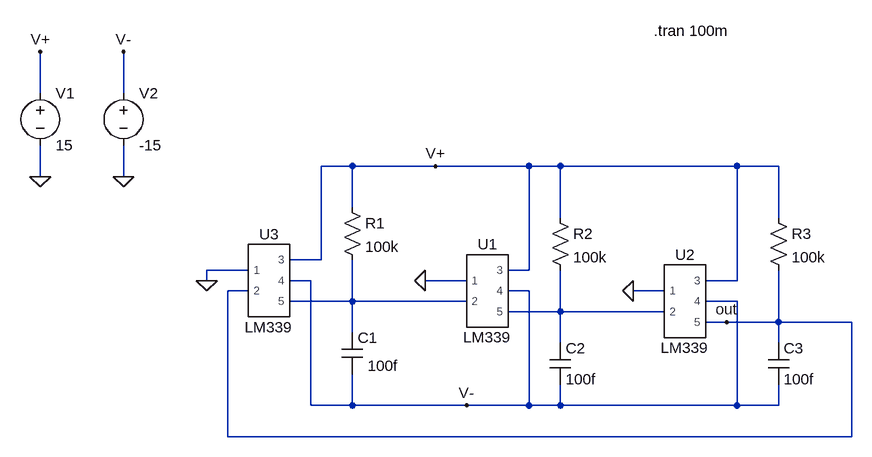
[diagram p0: schematic LM339_schema.asc]
LM339_schema.asc, the LTspice schematic file:
Version 4
SHEET 1 880 680
WIRE -512 -112 -512 -176
WIRE -384 -112 -384 -176
WIRE -32 0 -80 0
WIRE 96 0 -32 0
WIRE 240 0 96 0
WIRE 288 0 240 0
WIRE 560 0 288 0
WIRE 624 0 560 0
WIRE -512 16 -512 -32
WIRE -384 16 -384 -32
WIRE -32 64 -32 0
WIRE 288 80 288 0
WIRE 624 80 624 0
WIRE -80 144 -80 0
WIRE -80 144 -128 144
WIRE -192 160 -256 160
WIRE 240 160 240 0
WIRE 240 160 208 160
WIRE -256 176 -256 160
WIRE -96 176 -128 176
WIRE 144 176 80 176
WIRE 560 176 560 0
WIRE 560 176 512 176
WIRE -192 192 -224 192
WIRE 240 192 208 192
WIRE 448 192 400 192
WIRE -32 208 -32 144
WIRE -32 208 -128 208
WIRE 144 208 -32 208
WIRE 560 208 512 208
WIRE 288 224 288 160
WIRE 288 224 208 224
WIRE 448 224 288 224
WIRE 544 240 512 240
WIRE 624 240 624 160
WIRE 624 240 544 240
WIRE 736 240 624 240
WIRE -32 256 -32 208
WIRE 288 272 288 224
WIRE 624 272 624 240
WIRE -96 368 -96 176
WIRE -32 368 -32 320
WIRE -32 368 -96 368
WIRE 144 368 -32 368
WIRE 240 368 240 192
WIRE 240 368 144 368
WIRE 288 368 288 336
WIRE 288 368 240 368
WIRE 560 368 560 208
WIRE 560 368 288 368
WIRE 624 368 624 336
WIRE 624 368 560 368
WIRE -224 416 -224 192
WIRE 736 416 736 240
WIRE 736 416 -224 416
FLAG -256 176 0
FLAG 96 0 V+
FLAG 144 368 V-
FLAG 80 176 0
FLAG 400 192 0
FLAG -512 16 0
FLAG -384 16 0
FLAG -512 -176 V+
FLAG -384 -176 V-
FLAG 544 240 out
SYMBOL LM339 176 192 R0
SYMATTR InstName U1
SYMBOL LM339 480 208 R0
SYMATTR InstName U2
SYMBOL LM339 -160 176 R0
SYMATTR InstName U3
SYMBOL res -48 48 R0
SYMATTR InstName R1
SYMATTR Value 100k
SYMBOL res 272 64 R0
SYMATTR InstName R2
SYMATTR Value 100k
SYMBOL res 608 64 R0
SYMATTR InstName R3
SYMATTR Value 100k
SYMBOL cap -48 256 R0
WINDOW 3 40 51 Left 2
SYMATTR Value 100f
SYMATTR InstName C1
SYMBOL cap 272 272 R0
SYMATTR InstName C2
SYMATTR Value 100f
SYMBOL cap 608 272 R0
SYMATTR InstName C3
SYMATTR Value 100f
SYMBOL voltage -512 -128 R0
WINDOW 123 0 0 Left 2
WINDOW 39 0 0 Left 2
SYMATTR InstName V1
SYMATTR Value 15
SYMBOL voltage -384 -128 R0
WINDOW 123 0 0 Left 2
WINDOW 39 0 0 Left 2
SYMATTR InstName V2
SYMATTR Value -15
TEXT 432 -208 Left 2 !.tran 100m

The netlist it stands for:
* LM339_schema.asc
XU1 0 N001 V+ V- N002 LM339  ; pins 1 2 3 4 5
XU2 0 N002 V+ V- out LM339  ; pins 1 2 3 4 5
XU3 0 out V+ V- N001 LM339  ; pins 1 2 3 4 5
R1 V+ N001 100k
R2 V+ N002 100k
R3 V+ out 100k
C1 N001 V- 100f
C2 N002 V- 100f
C3 out V- 100f
V1 V+ 0 15
V2 V- 0 -15
.tran 100m
.lib C:\Users\user\Desktop\NAPOSIP\LM339 si LM1011\LM339.5_1
.backanno
.end